# Altium schematic sheet i2c_rj45.SchDoc
size A
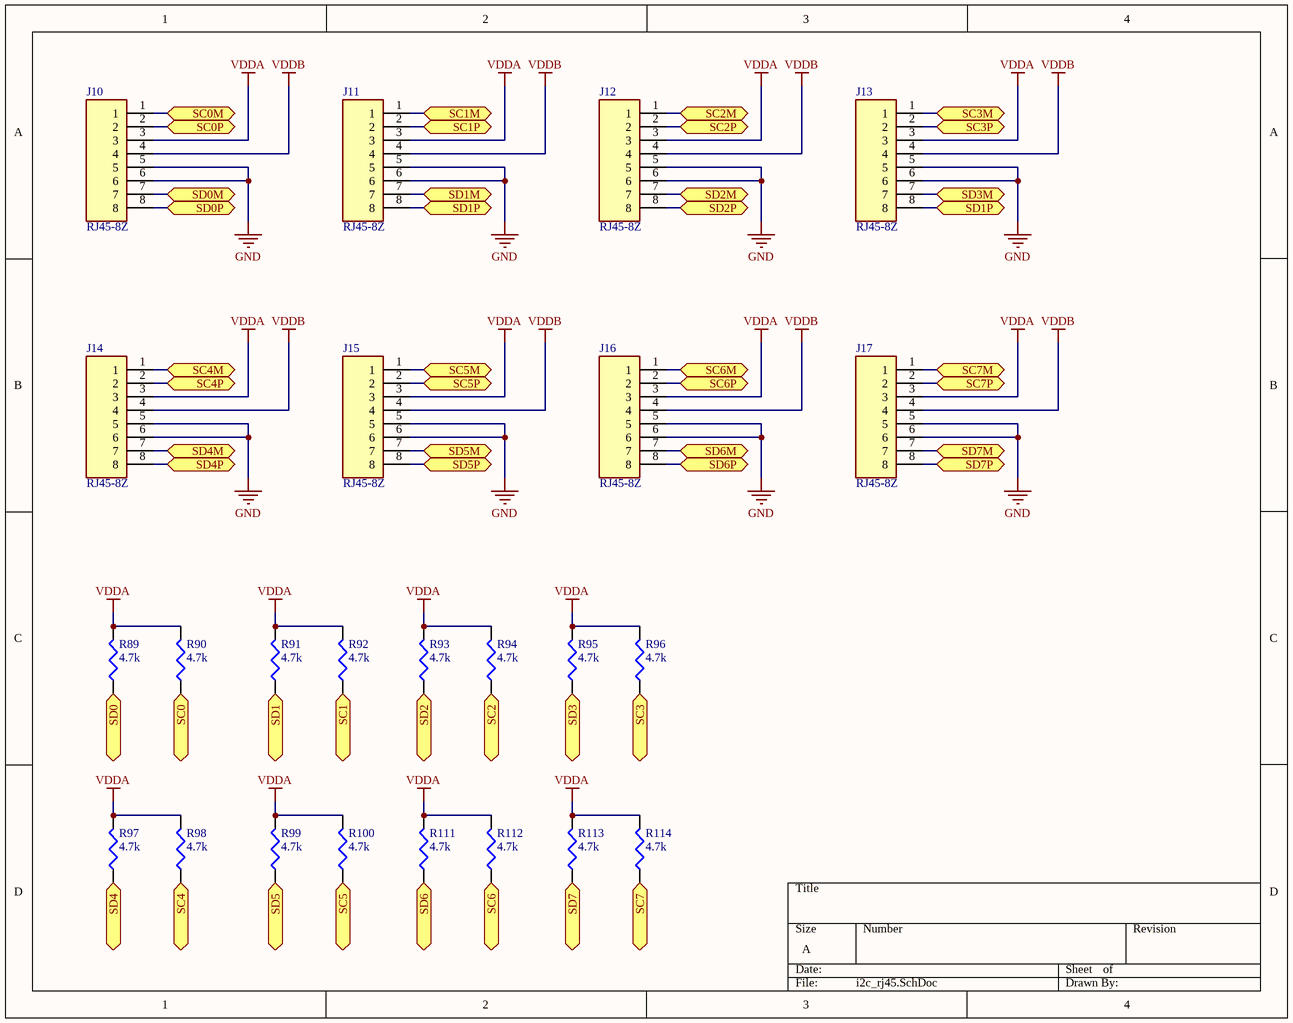
[diagram p0: i2c_rj45.SchDoc]

## Parts
J10  RJ45-8Z  [CONN_RJ45-8Z]
J11  RJ45-8Z  [CONN_RJ45-8Z]
J12  RJ45-8Z  [CONN_RJ45-8Z]
J13  RJ45-8Z  [CONN_RJ45-8Z]
J14  RJ45-8Z  [CONN_RJ45-8Z]
J15  RJ45-8Z  [CONN_RJ45-8Z]
J16  RJ45-8Z  [CONN_RJ45-8Z]
J17  RJ45-8Z  [CONN_RJ45-8Z]
R89  4.7k  [J1-0603]
R90  4.7k  [J1-0603]
R91  4.7k  [J1-0603]
R92  4.7k  [J1-0603]
R93  4.7k  [J1-0603]
R94  4.7k  [J1-0603]
R95  4.7k  [J1-0603]
R96  4.7k  [J1-0603]
R97  4.7k  [J1-0603]
R98  4.7k  [J1-0603]
R99  4.7k  [J1-0603]
R100  4.7k  [J1-0603]
R111  4.7k  [J1-0603]
R112  4.7k  [J1-0603]
R113  4.7k  [J1-0603]
R114  4.7k  [J1-0603]

## Ports
SC0 (bidir), SC0M (bidir), SC0P (bidir), SC1 (bidir), SC1M (bidir), SC1P (bidir), SC2 (bidir), SC2M (bidir), SC2P (bidir), SC3 (bidir), SC3M (bidir), SC3P (bidir), SC4 (bidir), SC4M (bidir), SC4P (bidir), SC5 (bidir), SC5M (bidir), SC5P (bidir), SC6 (bidir), SC6M (bidir), SC6P (bidir), SC7 (bidir), SC7M (bidir), SC7P (bidir), SD0 (bidir), SD0M (bidir), SD0P (bidir), SD1 (bidir), SD1M (bidir), SD1P (bidir), SD2 (bidir), SD2M (bidir), SD2P (bidir), SD3 (bidir), SD3M (bidir), SD4 (bidir), SD4M (bidir), SD4P (bidir), SD5 (bidir), SD5M (bidir), SD5P (bidir), SD6 (bidir), SD6M (bidir), SD6P (bidir), SD7 (bidir), SD7M (bidir), SD7P (bidir)

## Nets
GND: J10.5 J10.6 J11.5 J11.6 J12.5 J12.6 J13.5 J13.6 J14.5 J14.6 J15.5 J15.6 J16.5 J16.6 J17.5 J17.6
VDDA: J10.3 J11.3 J12.3 J13.3 J14.3 J15.3 J16.3 J17.3 R89.2 R90.2 R91.2 R92.2 R93.2 R94.2 R95.2 R96.2 R97.2 R98.2 R99.2 R100.2 R111.2 R112.2 R113.2 R114.2
VDDB: J10.4 J11.4 J12.4 J13.4 J14.4 J15.4 J16.4 J17.4
SC0: R90.1 ; port SC0
SC0M: J10.1 ; port SC0M
SC0P: J10.2 ; port SC0P
SC1: R92.1 ; port SC1
SC1M: J11.1 ; port SC1M
SC1P: J11.2 ; port SC1P
SC2: R94.1 ; port SC2
SC2M: J12.1 ; port SC2M
SC2P: J12.2 ; port SC2P
SC3: R96.1 ; port SC3
SC3M: J13.1 ; port SC3M
SC3P: J13.2 ; port SC3P
SC4: R98.1 ; port SC4
SC4M: J14.1 ; port SC4M
SC4P: J14.2 ; port SC4P
SC5: R100.1 ; port SC5
SC5M: J15.1 ; port SC5M
SC5P: J15.2 ; port SC5P
SC6: R112.1 ; port SC6
SC6M: J16.1 ; port SC6M
SC6P: J16.2 ; port SC6P
SC7: R114.1 ; port SC7
SC7M: J17.1 ; port SC7M
SC7P: J17.2 ; port SC7P
SD0: R89.1 ; port SD0
SD0M: J10.7 ; port SD0M
SD0P: J10.8 ; port SD0P
SD1: R91.1 ; port SD1
SD1M: J11.7 ; port SD1M
SD1P: J11.8 J13.8 ; port SD1P
SD2: R93.1 ; port SD2
SD2M: J12.7 ; port SD2M
SD2P: J12.8 ; port SD2P
SD3: R95.1 ; port SD3
SD3M: J13.7 ; port SD3M
SD4: R97.1 ; port SD4
SD4M: J14.7 ; port SD4M
SD4P: J14.8 ; port SD4P
SD5: R99.1 ; port SD5
SD5M: J15.7 ; port SD5M
SD5P: J15.8 ; port SD5P
SD6: R111.1 ; port SD6
SD6M: J16.7 ; port SD6M
SD6P: J16.8 ; port SD6P
SD7: R113.1 ; port SD7
SD7M: J17.7 ; port SD7M
SD7P: J17.8 ; port SD7P

## Library data of the parts
J10-J17 = RJ45-8Z: Jack Modular Connector 8p8c _RJ45, Ethernet_ 90Â° Angle _Right_ Shielded; MF: TE Connectivity; TE_purchase_URL: https://www.te.com/usa-en/product-RJ45-8Z.html?te_bu=Cor&te_type=disp&te_campaign=seda_glo_cor-seda-global-disp-prtnr-fy19-seda-model-bom-cta_sma-317_1&elqCampaignId=32493; Package: None; MP: RJ45-8Z; Value: *; Availability: Unavailable; SnapEDA_Link: https://www.snapeda.com/parts/RJ45-8Z/TE%20Connectivity%20Corcom%20Filters/view-part/51337/?ref=snap; Price: None
R89-R100 R111-R114 = Res3: Resistor; Value: 1K; Published: 8-Jun-2000; LatestRevisionDate: 29-May-2009; LatestRevisionNote: IPC-7351 Footprint Added.; PackageReference: J1-0603; Publisher: Altium Limited; PackageDescription: Chip Resistor